# Altium schematic sheet ReceiverSlave.SchDoc
size A; SheetNumber: 1; SheetTotal: 1
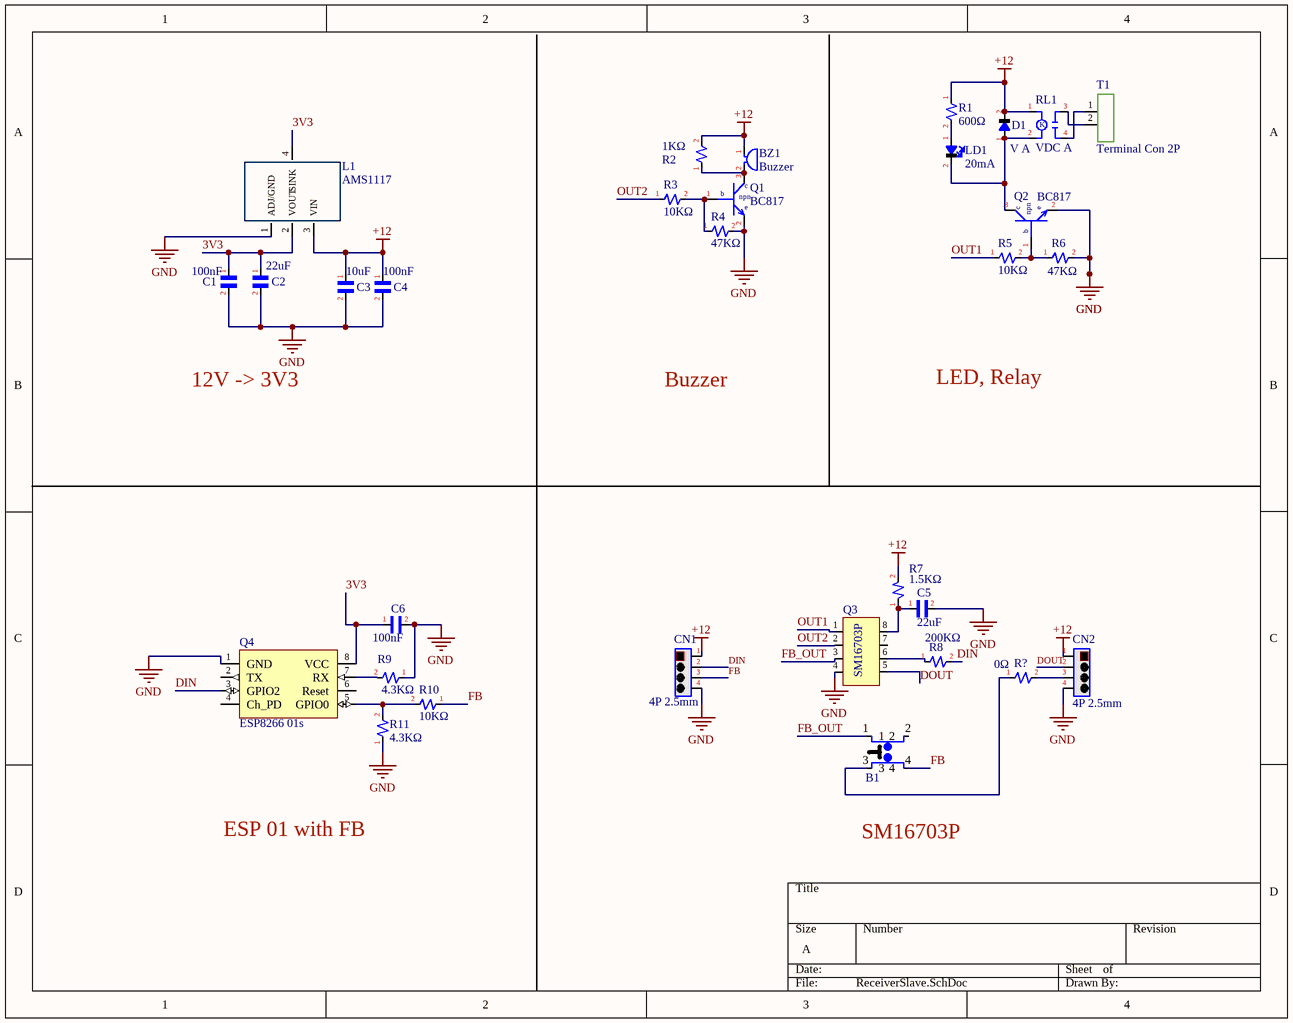
[diagram p0: ReceiverSlave.SchDoc]

## Parts
B1  Push Button  [Push button 4 pin]  (value not drawn)
BZ1  Buzzer  [LS_12.2x6.5_P5_PS1240P02BT]
C1  100nF  [C_0805]
C2  22uF  [C_0805]
C3  10uF  [C_0805]
C4  100nF  [C_0805]
C5  22uF  [C_0805]
C6  100nF  [C_0805]
CN1  4P 2.5mm  [CN_B4B-XH-A_BLUE _RightAngle]
CN2  4P 2.5mm  [CN_B4B-XH-A_BLUE _RightAngle]
D1  V A  [D_DO214AC-ES1J]
L1  AMS1117  [AMS1117]
LD1  20mA  [LED_3x5_P2.5]
Q1  BC817  [BC817]
Q2  BC817  [BC817]
Q3  SM16703P  [SM16703P]
Q4  ESP8266 01s  [Esp01]
R1  600Ω  [R_0805]
R2  1KΩ  [R_0805]
R3  10KΩ  [R_0805]
R4  47KΩ  [R_0805]
R5  10KΩ  [R_0805]
R6  47KΩ  [R_0805]
R7  1.5KΩ  [R_0805]
R8  200KΩ  [R_0805]
R9  4.3KΩ  [R_0805]
R10  10KΩ  [R_0805]
R11  4.3KΩ  [R_0805]
R?  0Ω  [R_0805]
RL1  VDC A  [RL_SPST_5ARelay_AZ7709-1AB-12DE]
T1  Terminal Con 2P  [Terminal 2P]

## Nets
+12: BZ1.1(vdd) C3.1 C4.1 CN1.1 CN2.1 D1.2(K) L1.3(VIN) R1.1 R2.2 R7.2 RL1.1
GND: C1.2 C2.2 C3.2 C4.2 C5.2 C6.2 CN1.4 CN2.4 L1.1(ADJ/GND) Q1.2(Emitter) Q2.2(Emitter) Q3.4 Q4.1(GND) R4.2 R6.2 R9.1 R11.1
3V3: C1.1 C2.1 C6.1 L1.2(VOUT) L1.4(SINK) Q4.8(VCC)
DIN: CN1.2 Q4.3(GPIO2) R8.2
DOUT: CN2.2 Q3.5
FB: B1.4 CN1.3 R10.1
FB_OUT: B1.1 Q3.3
OUT1: Q3.1 R5.1
OUT2: Q3.2 R3.1
NetB1_3: B1.3 R?.1
NetBZ1_2: BZ1.2(vss) Q1.3(Collector) R2.1
NetC5_1: C5.1 Q3.8 R7.1
NetCN2_3: CN2.3 R?.2
NetD1_1: D1.1(A) LD1.2(vss) Q2.3(Collector) RL1.2
NetLD1_1: LD1.1(vdd) R1.2
NetQ1_1: Q1.1(Base) R3.2 R4.1
NetQ2_1: Q2.1(Base) R5.2 R6.1
NetQ3_6: Q3.6 R8.1
NetQ4_5: Q4.5(GPIO0) R10.2 R11.2
NetQ4_7: Q4.7(RX) R9.2
NetRL1_3: RL1.3 T1.2
NetRL1_4: RL1.4 T1.1

Not connected (* = marked no-connect by the designer): B1 2; Q3 7(NC); Q4 2(TX) 4(Ch_PD) 6(Reset)

## Notes on the sheet
- 12V -> 3V3
- Buzzer
- LED, Relay
- ESP 01 with FB
- (near B1) SM16703P
- (in symbol Relay>> SPST) K
- (in symbol Transistor>> BJT npn) c; e; npn; b

## Library data of the parts
B1 = Push Button 4 pin: 4 pin statndard push button
C1-C6 = Capacitor>> Non-Polar
CN1 CN2 = Connector>> 4Pins
D1 = Diode>> General Purpose
LD1 = LED>> General Purpose
Q1 Q2 = Transistor>> BJT npn
Q3 = SM16703P: Copy of WS2811
Q4 = ESP01
R1-R11 R? = Resistor>> General Purpose
RL1 = Relay>> SPST